# Altium schematic sheet ST1Sxx.SchDoc
size A4
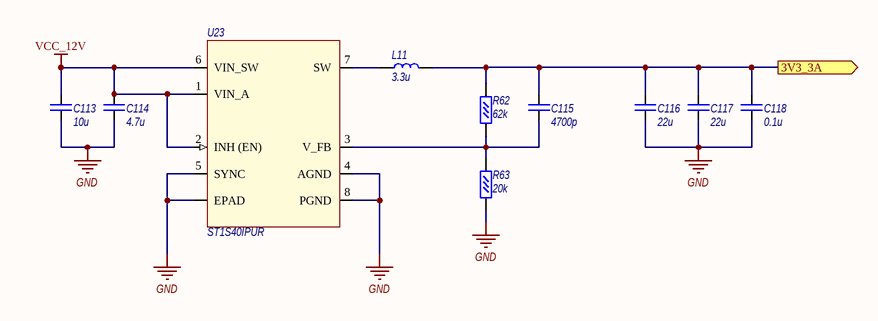
[diagram p0: ST1Sxx.SchDoc]

## Parts
C113  value 10u  [C0805]  (hidden comment: Конденсатор SMD, 10мкФ, X7R, 50В, 10%, 0805)
C114  value 4.7u  [C0805]  (hidden comment: Конденсатор SMD, 4.7мкФ, X7R, 50В, 10%, 0805)
C115  value 4700p  [C0402]  (hidden comment: Конденсатор SMD, 4700p, X7R, 6.3В, 10%, 0402)
C116  value 22u  [C0603]  (hidden comment: Конденсатор SMD, 22мкФ, X7R, 6.3В, 10%, 0603)
C117  value 22u  [C0603]  (hidden comment: Конденсатор SMD, 22мкФ, X7R, 6.3В, 10%, 0603)
C118  value 0.1u  [C0603]  (hidden comment: Конденсатор SMD, 0.1мкФ, X7R, 6.3В, 10%, 0603)
L11  value 3.3u  [SRP4020TA]  (hidden comment: Катушка индуктивности, 3.3мкГн, SRP4020TA-3R3M)
R62  value 62k  [R0402]  (hidden comment: Резистор SMD, 0.063Вт, 0402, 62кОм, 1%)
R63  value 20k  [R0402]  (hidden comment: Резистор SMD, 0.063Вт, 0402, 20кОм, 1%)
U23  PartNumber: ST1S40IPUR  [SON80P400X400X100-9N-D]  (hidden comment: Микросхема, ST1S40IPUR)

## Ports
3V3_3A (out)

## Nets
GND: C113.1 C114.1 C116.1 C117.1 C118.1 R63.1 U23.0(EPAD) U23.4(AGND) U23.5(SYNC) U23.8(PGND)
VCC_12V: C113.2 C114.2 U23.1(VIN_A) U23.2(INH_(EN)) U23.6(VIN_SW)
3V3_3A: C115.2 C116.2 C117.2 C118.2 L11.2 R62.2 ; port 3V3_3A
NetC115_1: C115.1 R62.1 R63.2 U23.3(V_FB)
NetL11_1: L11.1 U23.7(SW)

## Library data of the parts
C113 = C0805: Chip Capacitor 0805; Assembly: 10u_X7R_50V_10%_0805; Voltage_assembly: 50V; Voltage: 50В; Tolerance: 10%; TemperatureCoeff: X7R; Family: Конденсатор SMD; Package: 0805; Capacitance: 10мкФ
C114 = C0805: Chip Capacitor 0805; Assembly: 4.7u_X7R_50V_10%_0805; Voltage_assembly: 50V; Voltage: 50В; Tolerance: 10%; TemperatureCoeff: X7R; Family: Конденсатор SMD; Package: 0805; Capacitance: 4.7мкФ
C115 = C0402: Chip Capacitor 0402; Capacitance: 4700пФ; Assembly: 4700p_X7R_25V_10%_0402; Voltage_assembly: 25V; Voltage: 6.3В; Tolerance: 10%; TemperatureCoeff: X7R; Family: Конденсатор SMD; Package: 0402
C116 C117 = C0603: Chip Capacitor 0603; Voltage_assembly: 25V; Assembly: 22u_X7R_25V_10%_0603; Voltage: 6.3В; Tolerance: 10%; TemperatureCoeff: X7R; Family: Конденсатор SMD; Package: 0603; Capacitance: 22мкФ
C118 = C0603: Chip Capacitor 0603; Voltage_assembly: 25V; Assembly: 0.1u_X7R_25V_10%_0603; Voltage: 6.3В; Tolerance: 10%; TemperatureCoeff: X7R; Family: Конденсатор SMD; Package: 0603; Capacitance: 0.1мкФ
L11 = SRP4020TA: Shielded Power Inductor; Manufacturer: Bourns Inc.; PartNumber: SRP4020TA-3R3M; Inductance: 3.3мкГн; Family: Катушка индуктивности; Assembly: SRP4020TA-3R3M
R62 = R0402_0.063: Chip Resistor 0402, 0.063 W; Assembly: 62k_0.063W_1%_0402; Power_assembly: 0.063W; Power: 0.063Вт; Tolerance: 1%; Family: Резистор SMD; Package: 0402; Resistance: 62кОм
R63 = R0402_0.063: Chip Resistor 0402, 0.063 W; Assembly: 20k_0.063W_1%_0402; Power_assembly: 0.063W; Power: 0.063Вт; Tolerance: 1%; Family: Резистор SMD; Package: 0402; Resistance: 20кОм
U23 = ST1S10PHR: 3 A, 900 kHz, monolithic synchronous step-down regulator IC; Manufacturer: STMicroelectronics; Family: Микросхема; Package: VFQFPN; Assembly: ST1S40IPUR